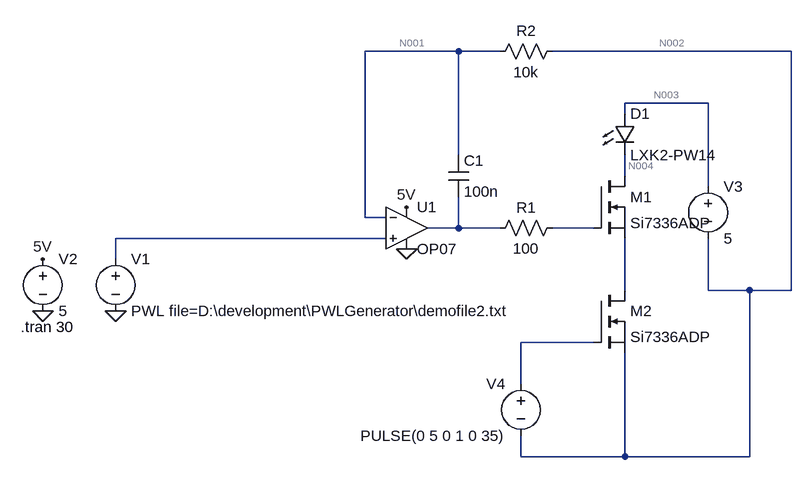
[diagram p0: schematic LaserControllerCircuit.asc]
LaserControllerCircuit.asc, the LTspice schematic file:
Version 4
SHEET 1 1160 680
WIRE 528 -96 384 -96
WIRE 592 -96 528 -96
WIRE 1040 -96 672 -96
WIRE 912 -16 784 -16
WIRE 784 0 784 -16
WIRE 528 64 528 -96
WIRE 784 96 784 64
WIRE 912 112 912 -16
WIRE 384 160 384 -96
WIRE 416 160 384 160
WIRE 528 176 528 128
WIRE 528 176 480 176
WIRE 592 176 528 176
WIRE 736 176 672 176
WIRE 416 192 0 192
WIRE 0 224 0 192
WIRE 784 272 784 192
WIRE 912 272 912 192
WIRE 976 272 912 272
WIRE 1040 272 1040 -96
WIRE 1040 272 976 272
WIRE 736 352 624 352
WIRE 624 416 624 352
WIRE 624 528 624 496
WIRE 784 528 784 368
WIRE 784 528 624 528
WIRE 976 528 976 272
WIRE 976 528 784 528
FLAG -112 224 5V
FLAG -112 304 0
FLAG 448 208 0
FLAG 448 144 5V
FLAG 0 304 0
SYMBOL voltage 0 208 R0
WINDOW 123 0 0 Left 0
WINDOW 39 0 0 Left 0
SYMATTR InstName V1
SYMATTR Value PWL file=D:\development\PWLGenerator\demofile2.txt
SYMBOL OpAmps\\OP07 448 112 R0
SYMATTR InstName U1
SYMBOL voltage -112 208 R0
WINDOW 123 0 0 Left 0
WINDOW 39 0 0 Left 0
SYMATTR InstName V2
SYMATTR Value 5
SYMBOL res 688 160 R90
WINDOW 0 0 56 VBottom 2
WINDOW 3 32 56 VTop 2
SYMATTR InstName R1
SYMATTR Value 100
SYMBOL res 688 -112 R90
WINDOW 0 0 56 VBottom 2
WINDOW 3 32 56 VTop 2
SYMATTR InstName R2
SYMATTR Value 10k
SYMBOL nmos 736 96 R0
SYMATTR InstName M1
SYMATTR Value Si7336ADP
SYMBOL voltage 912 96 R0
WINDOW 123 0 0 Left 0
WINDOW 39 0 0 Left 0
SYMATTR InstName V3
SYMATTR Value 5
SYMBOL LED 768 0 R0
SYMATTR InstName D1
SYMATTR Value LXK2-PW14
SYMBOL cap 512 64 R0
SYMATTR InstName C1
SYMATTR Value 100n
SYMBOL nmos 736 272 R0
SYMATTR InstName M2
SYMATTR Value Si7336ADP
SYMBOL voltage 624 400 M0
WINDOW 123 0 0 Left 0
WINDOW 39 0 0 Left 0
SYMATTR InstName V4
SYMATTR Value PULSE(0 5 0 1 0 35)
TEXT -146 328 Left 2 !.tran 30

The netlist it stands for:
* LaserControllerCircuit.asc
V1 N007 0 PWL file=D:\development\PWLGenerator\demofile2.txt
XU1 N007 N001 5V 0 N005 LT1001  ; OP07, pins In+ In- V+ V- OUT
V2 5V 0 5
R1 N006 N005 100
R2 N002 N001 10k
M1 N004 N006 N008 N008 Si7336ADP
V3 N003 N002 5
D1 N003 N004 LXK2-PW14
C1 N001 N005 100n
M2 N008 N009 N002 N002 Si7336ADP
V4 N009 N002 PULSE(0 5 0 1 0 35)
.model D D
.lib standard.dio
.model NMOS NMOS
.model PMOS PMOS
.lib standard.mos
.tran 30
.lib LTC.lib
.backanno
.end

* Results of the author's LTspice run, read from the files saved beside the schematic
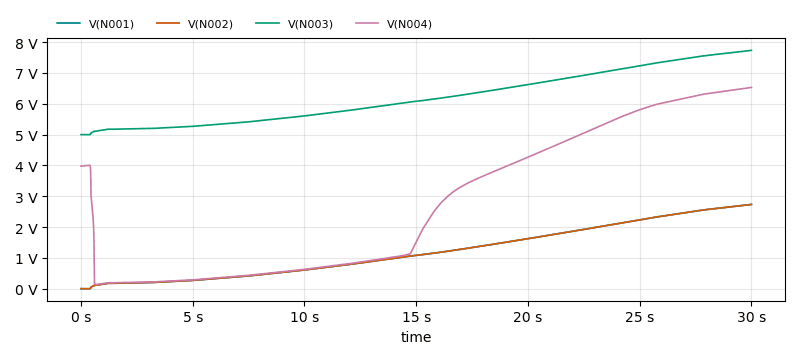
[diagram p1: Transient Analysis of LaserControllerCircuit.asc, plotted from the saved traces]
* Transient Analysis, 1 run:
*   V(N001): min -3.489 mV, max 2.734 V, average 1.202 V, rms 1.462 V, last 2.734 V
*   V(N002): min -3.666 mV, max 2.734 V, average 1.202 V, rms 1.462 V, last 2.734 V
*   V(N003): min 4.996 V, max 7.734 V, average 6.202 V, rms 6.258 V, last 7.734 V
*   V(N004): min 138.6 mV, max 6.531 V, average 2.757 V, rms 3.622 V, last 6.531 V